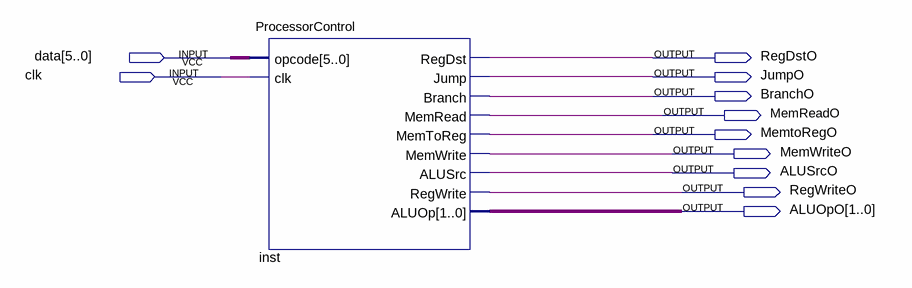
[diagram p0: schematic sheet]
// Quartus schematic testBlockFile.bdf as structural Verilog: 1 symbols, 11 pins
module testBlockFile (
  input  [5:0] data,
  input  clk,
  output RegDstO,
  output JumpO,
  output BranchO,
  output MemReadO,
  output MemtoRegO,
  output MemWriteO,
  output ALUSrcO,
  output RegWriteO,
  output [1:0] ALUOpO
);

  ProcessorControl inst (
    .opcode(data), .clk(clk), .RegDst(RegDstO), .Jump(JumpO), .Branch(BranchO), .MemRead(MemReadO),
    .MemToReg(MemtoRegO), .MemWrite(MemWriteO), .ALUSrc(ALUSrcO), .RegWrite(RegWriteO), .ALUOp(ALUOpO));
endmodule
